# EAGLE schematic MadHaddrMkrZero (EAGLE 8.3.2)
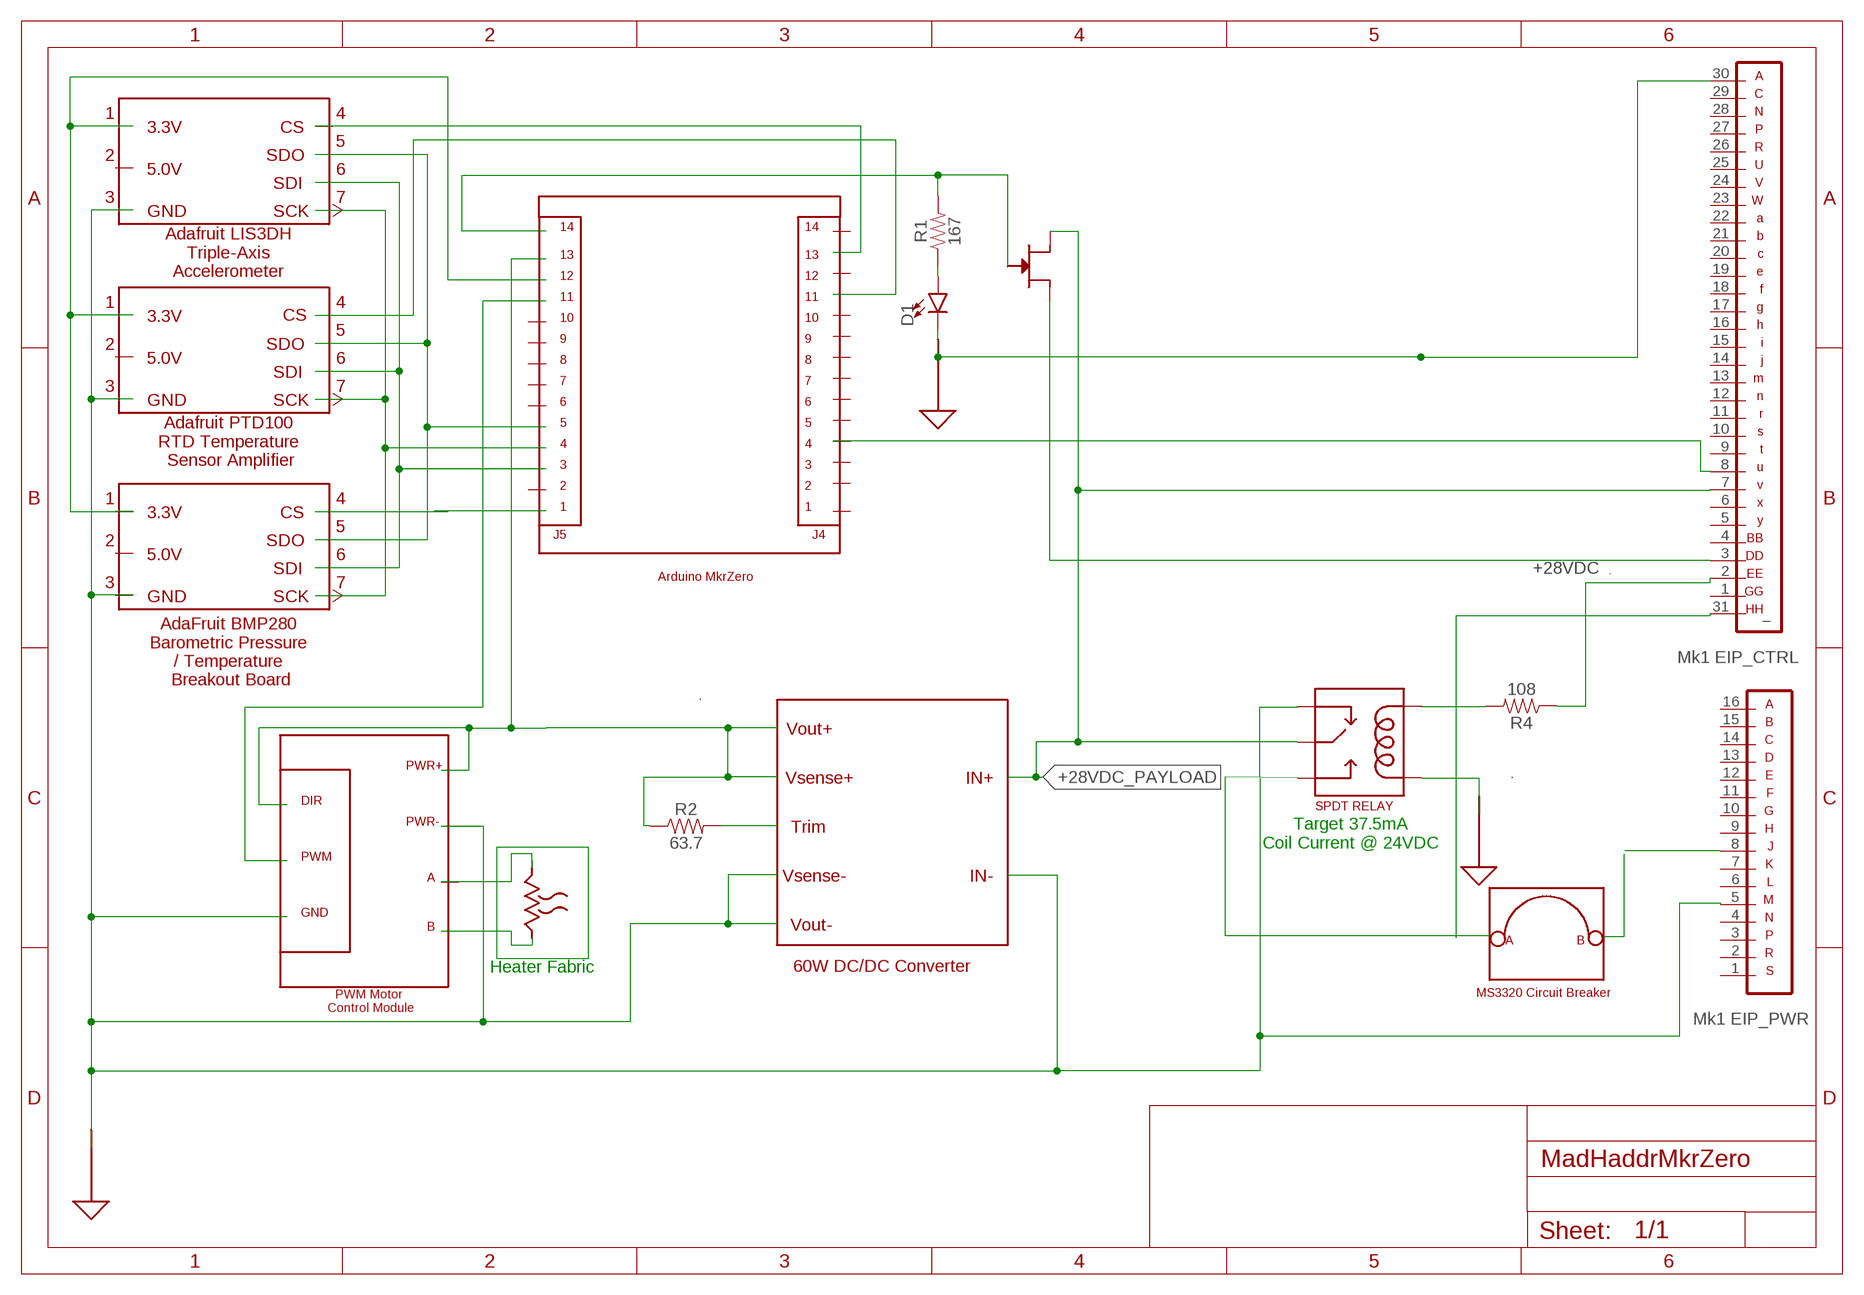
[diagram p0: schematic, sheet 1]

## Parts
D1  LED3MM  [LED_3MM]
J1  SDGDSGG  [1X30]
R1  167  0.1OHM-1210-1/2W-1%  [1210]
R2  63.7  0.1OHM-1210-1/2W-1%  [1210]
R4  108  0.1OHM-1210-1/2W-1%  [1210]
U$1  28VDC_TO_5VDC_PWR_SUPPLY  [28VDC_TO_5VDC_PWR_SUPPLY]
U$2  SPI_TEMP  [SPI_TEMP]
U$3  SPI_TEMP2  [SPI_TEMP]
U$4  SPI_ACCEL  [SPI_TEMP]
U$5  MKRZERO  [MKRZERO]
U$6  GND  [GND]
U$7  PWM_DRIVER  [PWM_DRIVER]
U$8  FET  [FET]
U$9  GND  [GND]
U$10  MK1_EIP_PWR  [1X16]
U$11  HEATER  [HEATER]
U$12  BREAKER  [BREAKER]
U$13  SPDT_RELAY  [RELAY-JZC]
U$14  GND  [GND]

## Nets
+28VDC_PAYLOAD: J1.7 U$1.P$6 U$8.P$1 U$13.3(MAIN)
FAIL_LIGHT: R1.2 U$5.P$1 U$8.P$3
N$1: U$4.P$5(SCK/SCL_5V) U$5.P$27
N$2: U$2.P$6(SDI/SDA_5V) U$3.P$6(SDI/SDA_5V) U$4.P$6(SDI/SDA_5V) U$5.P$6
N$3: U$2.P$7(SDO/ADR_3V) U$3.P$7(SDO/ADR_3V) U$4.P$7(SDO/ADR_3V) U$5.P$18
N$5: U$2.P$3(CS_5V) U$3.P$3(CS_5V) U$4.P$3(CS_5V) U$5.P$5
N$6: U$7.P$6 U$11.P$2
N$8: U$5.P$3 U$7.P$2
N$9: R4.2 U$13.1(COIL1)
N$11: U$12.P$2 U$13.5(NO)
N$12: R2.1 U$1.P$1 U$1.P$2 U$5.P$2 U$7.P$1 U$7.P$4
N$13: U$3.P$5(SCK/SCL_5V) U$5.P$25
N$14: U$2.P$5(SCK/SCL_5V) U$5.P$8
N$15: U$10.8
N$16: J1.2 R4.1
N$18: U$2.P$1(3.3V) U$3.P$1(3.3V) U$4.P$1(3.3V) U$5.P$4
N$19: D1.A R1.1
N$20: U$7.P$7 U$11.P$1
N$21: J1.3 U$8.P$2
N$22: U$1.P$4 U$1.P$5 U$1.P$7 U$2.P$4(GND) U$3.P$4(GND) U$4.P$4(GND) U$6.P$1 U$7.P$3 U$7.P$5 U$10.5
N$23: U$13.4(NC)
N$24: R2.2 U$1.P$3
N$25: U$12.P$1
N$26: J1.31(_)
N$27: U$13.2(COIL2) U$14.P$1
N$28: J1.8 U$5.P$11
N$29: D1.K(C) J1.30 U$9.P$1
Unconnected: J1.1 J1.4 J1.5 J1.6 J1.9 J1.10 J1.11 J1.12 J1.13 J1.14 J1.15 J1.16 J1.17 J1.18 J1.19 J1.20 J1.21 J1.22 J1.23 J1.24 J1.25 J1.26 J1.27 J1.28 J1.29 U$2.P$2(5.0V) U$3.P$2(5.0V) U$4.P$2(5.0V) U$5.P$7 U$5.P$9 U$5.P$10 U$5.P$12 U$5.P$13 U$5.P$14 U$5.P$15 U$5.P$16 U$5.P$17 U$5.P$19 U$5.P$20 U$5.P$21 U$5.P$22 U$5.P$23 U$5.P$24 U$5.P$26 U$5.P$28 U$10.1 U$10.2 U$10.3 U$10.4 U$10.6 U$10.7 U$10.9 U$10.10 U$10.11 U$10.12 U$10.13 U$10.14 U$10.15 U$10.16

## Notes on the sheet
- Target 37.5mA
  Coil Current @ 24VDC
- Heater Fabric

## Library data of the parts
D1 = SparkFun-LED:LED: LED (Generic) Standard schematic elements and footprints for 5mm, 3mm, 1206, and 0603 sized LEDs. Generic LEDs with no color specified.; PROD_ID: DIO-08794
J1 = madHaddr:SDGDSGG
R1 R2 R4 = SparkFun-Resistors:0.1OHM: 0.1Ω resistor A resistor is a passive two-terminal electrical component that implements electrical resistance as a circuit element. Resistors act to reduce current flow, and, at the same time, act to lower voltage levels within circuits. - Wikipedia; PROD_ID: RES-12374; VALUE: 0.1
U$1 = madHaddr:28VDC_TO_5VDC_PWR_SUPPLY
U$2 = madHaddr:SPI_TEMP
U$3 = madHaddr:SPI_TEMP2
U$4 = madHaddr:SPI_ACCEL
U$5 = madHaddr:MKRZERO
U$6 U$9 U$14 = madHaddr:GND
U$7 = madHaddr:PWM_DRIVER
U$8 = madHaddr:FET
U$10 = madHaddr:MK1_EIP_PWR
U$11 = madHaddr:HEATER
U$12 = madHaddr:BREAKER
U$13 = madHaddr:SPDT_RELAY